# Altium schematic sheet EEG.SchDoc
size A4
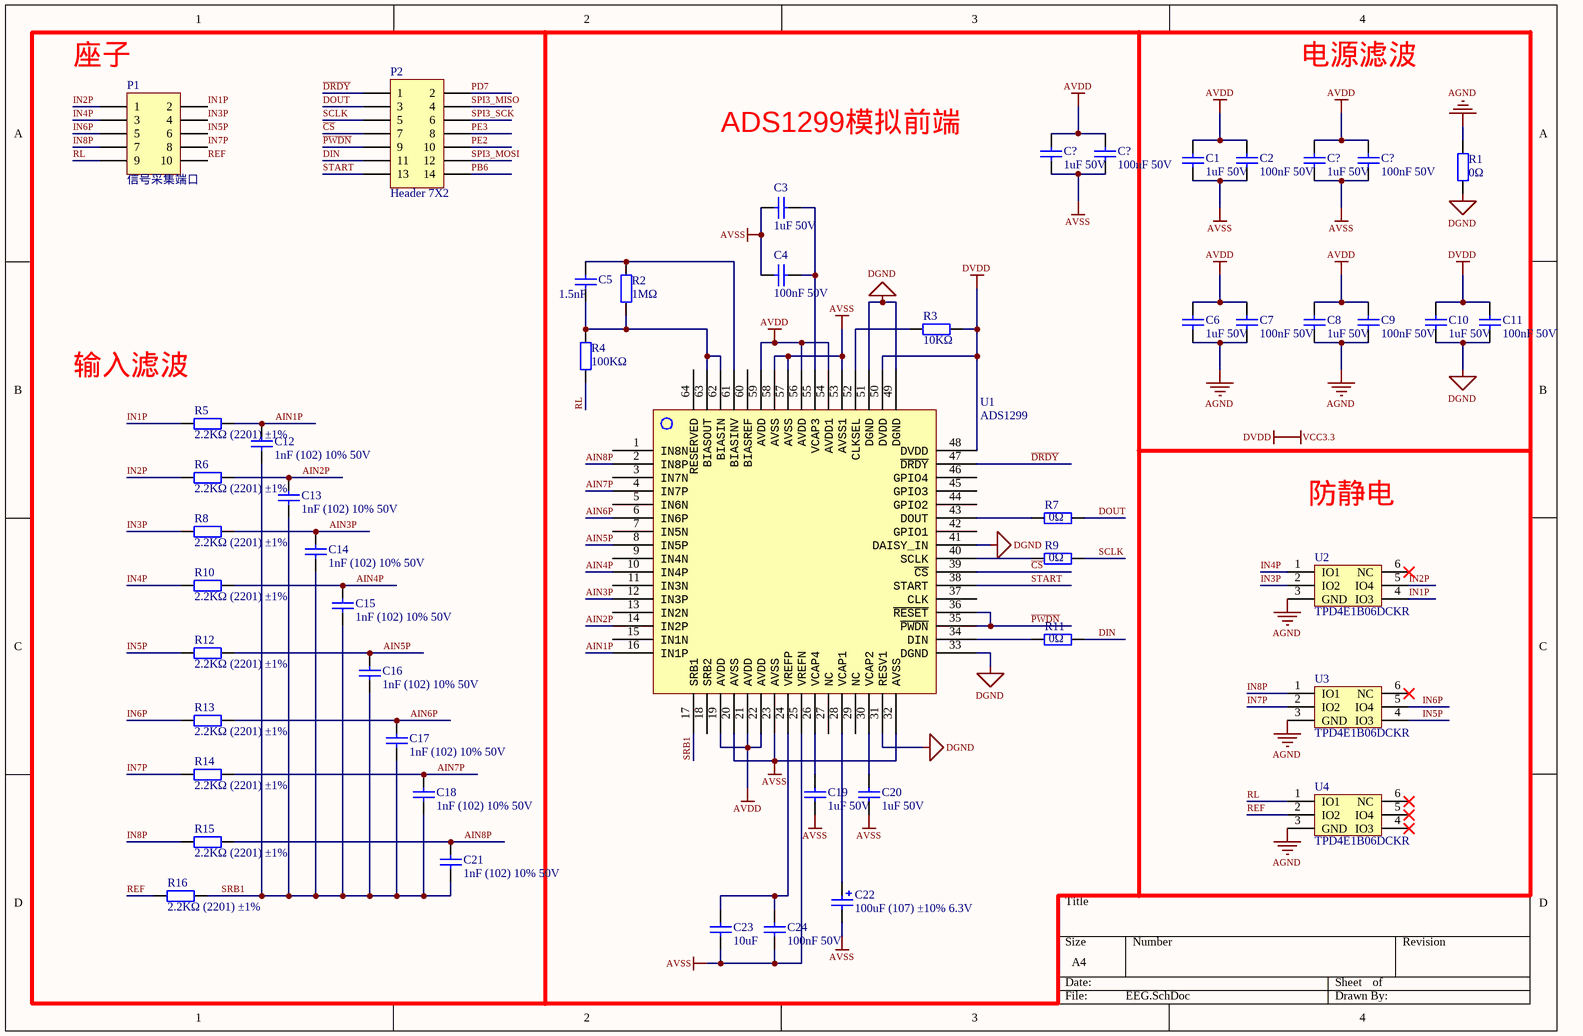
[diagram p0: EEG.SchDoc]

## Parts
(Parts that share a designator on the sheet are numbered #1, #2 ... from top to bottom, then left to right.)
C1  1uF 50V  [0402_C]
C2  100nF 50V  [0402_C]
C3  1uF 50V  [0402_C]
C4  100nF 50V  [0402_C]
C5  1.5nF  [0402_C]
C6  1uF 50V  [0402_C]
C7  100nF 50V  [0402_C]
C8  1uF 50V  [0402_C]
C9  100nF 50V  [0402_C]
C10  1uF 50V  [0402_C]
C11  100nF 50V  [0402_C]
C12  1nF (102) 10% 50V  [0402_C]
C13  1nF (102) 10% 50V  [0402_C]
C14  1nF (102) 10% 50V  [0402_C]
C15  1nF (102) 10% 50V  [0402_C]
C16  1nF (102) 10% 50V  [0402_C]
C17  1nF (102) 10% 50V  [0402_C]
C18  1nF (102) 10% 50V  [0402_C]
C19  1uF 50V  [0402_C]
C20  1uF 50V  [0402_C]
C21  1nF (102) 10% 50V  [0402_C]
C22  100uF (107) ±10% 6.3V  [CASE-B_3528]
C23  10uF  [0402_C]
C24  100nF 50V  [0402_C]
C?#1  1uF 50V  [0402_C]
C?#2  100nF 50V  [0402_C]
C?#3  1uF 50V  [0402_C]
C?#4  100nF 50V  [0402_C]
P1  信号采集端口  [HDR2X5]
P2  Header 7X2  [HDR2X7]
R1  0Ω  [0402_R]
R2  1MΩ  [0402_R]
R3  10KΩ  [0402_R]
R4  100KΩ  [0402_R]
R5  2.2KΩ (2201) ±1%  [0402_R]
R6  2.2KΩ (2201) ±1%  [0402_R]
R7  0Ω  [0402_R]
R8  2.2KΩ (2201) ±1%  [0402_R]
R9  0Ω  [0402_R]
R10  2.2KΩ (2201) ±1%  [0402_R]
R11  0Ω  [0402_R]
R12  2.2KΩ (2201) ±1%  [0402_R]
R13  2.2KΩ (2201) ±1%  [0402_R]
R14  2.2KΩ (2201) ±1%  [0402_R]
R15  2.2KΩ (2201) ±1%  [0402_R]
R16  2.2KΩ (2201) ±1%  [0402_R]
U1  ADS1299  [LQFP-64_10x10x05P]
U2  TPD4E1B06DCKR  [TPD4]
U3  TPD4E1B06DCKR  [TPD4]
U4  TPD4E1B06DCKR  [TPD4]

## Nets
AGND: C6.2 C7.2 C8.2 C9.2 R1.2 U2.3(GND) U3.3(GND) U4.3(GND)
AVDD: C1.1 C2.1 C6.1 C7.1 C8.1 C9.1 C?#1.1 C?#2.1 C?#3.1 C?#4.1 U1.19(AVDD) U1.21(AVDD) U1.22(AVDD) U1.54(AVDD1) U1.56(AVDD) U1.59(AVDD)
AVSS: C1.2 C2.2 C3.2 C4.2 C19.2 C20.2 C22.2 C23.1 C24.2 C?#1.2 C?#2.2 C?#3.2 C?#4.2 U1.20(AVSS) U1.23(AVSS) U1.25(VREFN) U1.32(AVSS) U1.53(AVSS1) U1.57(AVSS) U1.58(AVSS)
DGND: C10.2 C11.2 R1.1 U1.31(RESV1) U1.33(DGND) U1.41(DAISY_IN) U1.49(DGND) U1.51(DGND)
DVDD: C10.1 C11.1 R3.1 U1.48(DVDD) U1.50(DVDD)  [also labelled VCC3.3]
AIN1P: C12.2 R5.2 U1.16(IN1P)
AIN2P: C13.2 R6.2 U1.14(IN2P)
AIN3P: C14.2 R8.2 U1.12(IN3P)
AIN4P: C15.2 R10.2 U1.10(IN4P)
AIN5P: C16.2 R12.2 U1.8(IN5P)
AIN6P: C17.2 R13.2 U1.6(IN6P)
AIN7P: C18.2 R14.2 U1.4(IN7P)
AIN8P: C21.2 R15.2 U1.2(IN8P)
~{CS}: P2.7 U1.39(~{CS})
~{DRDY}: P2.1 U1.47(~{DRDY})
DIN: P2.11 R11.1
DOUT: P2.3 R7.1
IN1P: P1.2 R5.1 U2.4(IO3)
IN2P: P1.1 R6.1 U2.5(IO4)
IN3P: P1.4 R8.1 U2.2(IO2)
IN4P: P1.3 R10.1 U2.1(IO1)
IN5P: P1.6 R12.1 U3.4(IO3)
IN6P: P1.5 R13.1 U3.5(IO4)
IN7P: P1.8 R14.1 U3.2(IO2)
IN8P: P1.7 R15.1 U3.1(IO1)
~{PWDN}: P2.9 U1.35(~{PWDN}) U1.36(~{RESET})
PB6: P2.14
PD7: P2.2
PE2: P2.10
PE3: P2.8
REF: P1.10 R16.1 U4.2(IO2)
RL: P1.9 R4.1 U4.1(IO1)
SCLK: P2.5 R9.1
SPI3_MISO: P2.4
SPI3_MOSI: P2.12
SPI3_SCK: P2.6
SRB1: C12.1 C13.1 C14.1 C15.1 C16.1 C17.1 C18.1 C21.1 R16.2 U1.17(SRB1)
START: P2.13 U1.38(START)
NetC3_1: C3.1 C4.1 U1.55(VCAP3)
NetC5_1: C5.1 R2.1 R4.2 U1.62(BIASIN) U1.63(BIASOUT)
NetC5_2: C5.2 R2.2 U1.61(BIASINV)
NetC19_1: C19.1 U1.26(VCAP4)
NetC20_1: C20.1 U1.30(VCAP2)
NetC22_1: C22.1 U1.28(VCAP1)
NetC23_2: C23.2 C24.1 U1.24(VREFP)
NetR3_2: R3.2 U1.52(CLKSEL)
NetR7_2: R7.2 U1.43(DOUT)
NetR9_2: R9.2 U1.40(SCLK)
NetR11_2: R11.2 U1.34(DIN)

Not connected (* = marked no-connect by the designer): U1 1(IN8N) 3(IN7N) 5(IN6N) 7(IN5N) 9(IN4N) 11(IN3N) 13(IN2N) 15(IN1N) 18(SRB2) 27(NC) 29(NC) 37(CLK) 42(GPIO1) 44(GPIO2) 45(GPIO3) 46(GPIO4) 60(BIASREF) 64(RESERVED); U2 6(NC)*; U3 6(NC)*; U4 4(IO3)* 5(IO4)* 6(NC)*

## Notes on the sheet
- (near P1) 座子
- 电源滤波
- ADS1299模拟前端
- 输入滤波
- 防静电

## Library data of the parts
C1-C11 C19 C20 C24 C?#1-C?#4 = 0603 10nF (103) 10% 50V: 贴片电容; ComponentLink1Description: 供应商链接; ComponentLink1URL: http://www.szlcsc.com/product/details_58143.html; Package: 0603; Supplier: LC; SuppliersPartNumber: C57112
C12-C18 C21 = 0402 1nF (102) 10% 50V: 贴片电容; ComponentLink1Description: 供应商链接; ComponentLink1URL: http://www.szlcsc.com/product/details_1875.html; Package: 0402; Supplier: LC; SuppliersPartNumber: C1523
C22 = 3528 100uF (107) 10% 6.3V: 钽电容; ComponentLink1Description: 供应商链接; ComponentLink1URL: http://www.szlcsc.com/product/details_16815.html; Package: 3528; Supplier: LC; SuppliersPartNumber: C16133
C23 = 0603 10uF (106) 10% 10V: 贴片电容; ComponentLink1Description: 供应商链接; ComponentLink1URL: http://www.szlcsc.com/product/details_20411.html; Package: 0603; Supplier: LC; SuppliersPartNumber: C19702
P1 = Header 5X2: Header, 5-Pin, Dual row; LatestRevisionDate: 17-Jul-2002; LatestRevisionNote: Re-released for DXP Platform.; Publisher: Altium Limited
P2 = Header 7X2: Header, 7-Pin, Dual row; LatestRevisionDate: 17-Jul-2002; LatestRevisionNote: Re-released for DXP Platform.; Publisher: Altium Limited
R1 R7 R9 R11 = 0402 0Ω (0R0) 1%: 贴片电阻; ComponentLink1Description: 供应商链接; ComponentLink1URL: http://www.szlcsc.com/product/details_17853.html; Package: 0402; Supplier: LC; SuppliersPartNumber: C17168
R2 R4 = 0603 100KΩ (1003) 1%: 贴片电阻; ComponentLink1Description: 供应商链接; ComponentLink1URL: http://www.szlcsc.com/product/details_26546.html; Package: 0603; Supplier: LC; SuppliersPartNumber: C25803
R3 = 0603 10KΩ (1002) 1%: 贴片电阻; ComponentLink1Description: 供应商链接; ComponentLink1URL: http://www.szlcsc.com/product/details_26547.html; Package: 0603; Supplier: LC; SuppliersPartNumber: C25804
R5 R6 R8 R10 R12-R16 = 0402 2.2KΩ (2201) 1%: 贴片电阻; ComponentLink1Description: 供应商链接; ComponentLink1URL: http://www.szlcsc.com/product/details_26622.html; Package: 0402; Supplier: LC; SuppliersPartNumber: C25879